# Altium schematic sheet Tp_Buzzer.SchDoc
size A4
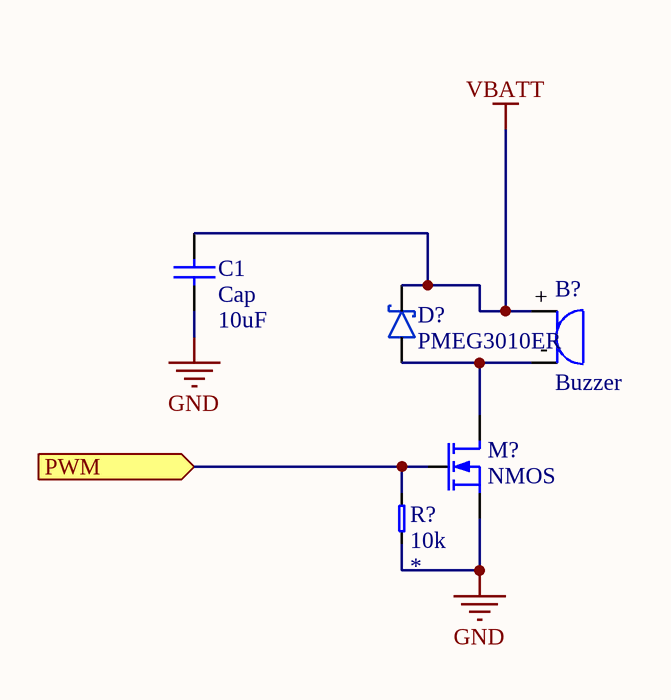
[diagram p0: Tp_Buzzer.SchDoc]

## Parts
B?  Buzzer  [SD160709]
C1  Cap  value 10uF  [RAD-0.3]
D?  PMEG3010ER  [SOD123W]
M?  NMOS  [MOSFET-SOT23]
R?  value 10k  [0603_RES_LD]  (hidden comment: Resistor)

## Ports
PWM (in)

## Nets
GND: C1.1 M?.S R?.1
VBATT: B?.+ C1.2 D?.K
PWM: M?.G R?.2 ; port PWM
NetB?_-: B?.- D?.A M?.D

## Library data of the parts
B? = SD160709: TDK SD160709 Buzzer; Reference: SD160709
C1 = Cap: Capacitor; Published: 8-Jun-2000; LatestRevisionDate: 17-Jul-2002; LatestRevisionNote: Re-released for DXP Platform.; PackageReference: RAD-0.3; Publisher: Altium Limited; PackageDescription: Radial Cap, Thru-Hole; 2 Leads; 0.3 in Pin Spacing
D? = Schottky_PMEG3010ER: Nexperia 1A low Vf Mega Schottky barrier rectifier; Reference: PMEG3010ER
M? = N-MOSFET: N MOSFET
R? = Resistor: Precision: *; Package: *